# Altium schematic sheet WiCam_RF.SchDoc
size B
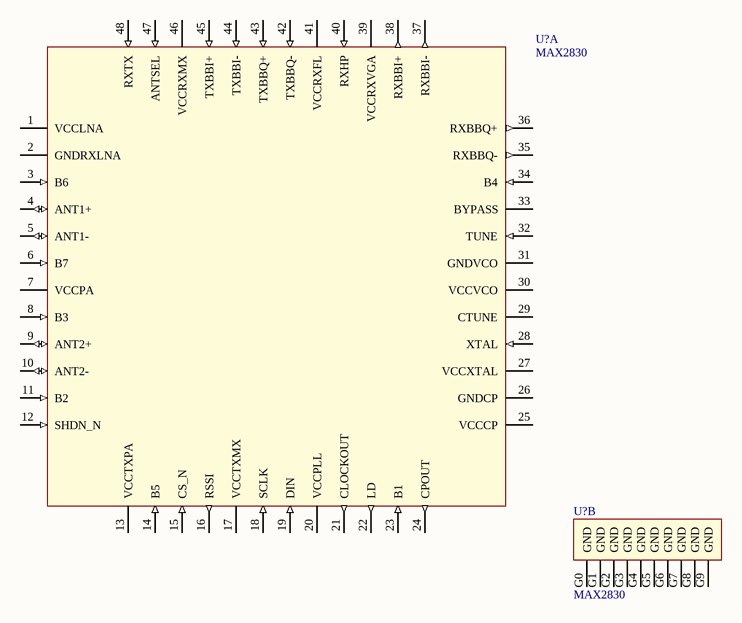
[diagram p0: WiCam_RF.SchDoc]

## Parts
(Parts that share a designator on the sheet are numbered #1, #2 ... from top to bottom, then left to right.)
U?#1  MAX2830  [MAXIM T4877-4]  (part A of 2)
U?#2  MAX2830  [MAXIM T4877-4]  (part B of 2)

## Nets

Not connected (* = marked no-connect by the designer): U?#1 1(VCCLNA) 2(GNDRXLNA) 3(B6) 4(ANT1+) 5(ANT1-) 6(B7) 7(VCCPA) 8(B3) 9(ANT2+) 10(ANT2-) 11(B2) 12(SHDN_N) 13(VCCTXPA) 14(B5) 15(CS_N) 16(RSSI) 17(VCCTXMX) 18(SCLK) 19(DIN) 20(VCCPLL) 21(CLOCKOUT) 22(LD) 23(B1) 24(CPOUT) 25(VCCCP) 26(GNDCP) 27(VCCXTAL) 28(XTAL) 29(CTUNE) 30(VCCVCO) 31(GNDVCO) 32(TUNE) 33(BYPASS) 34(B4) 35(RXBBQ-) 36(RXBBQ+) 37(RXBBI-) 38(RXBBI+) 39(VCCRXVGA) 40(RXHP) 41(VCCRXFL) 42(TXBBQ-) 43(TXBBQ+) 44(TXBBI-) 45(TXBBI+) 46(VCCRXMX) 47(ANTSEL) 48(RXTX); U?#2 G0(GND) G1(GND) G2(GND) G3(GND) G4(GND) G5(GND) G6(GND) G7(GND) G8(GND) G9(GND)

## Library data of the parts
U?#1 U?#2 = MAX2830: MAXIM MAX2830 2.4GHZ RXTX